# EAGLE schematic Modulator_V1p2 (EAGLE 9.6.2)

## Sheet 1 of 5: Logic
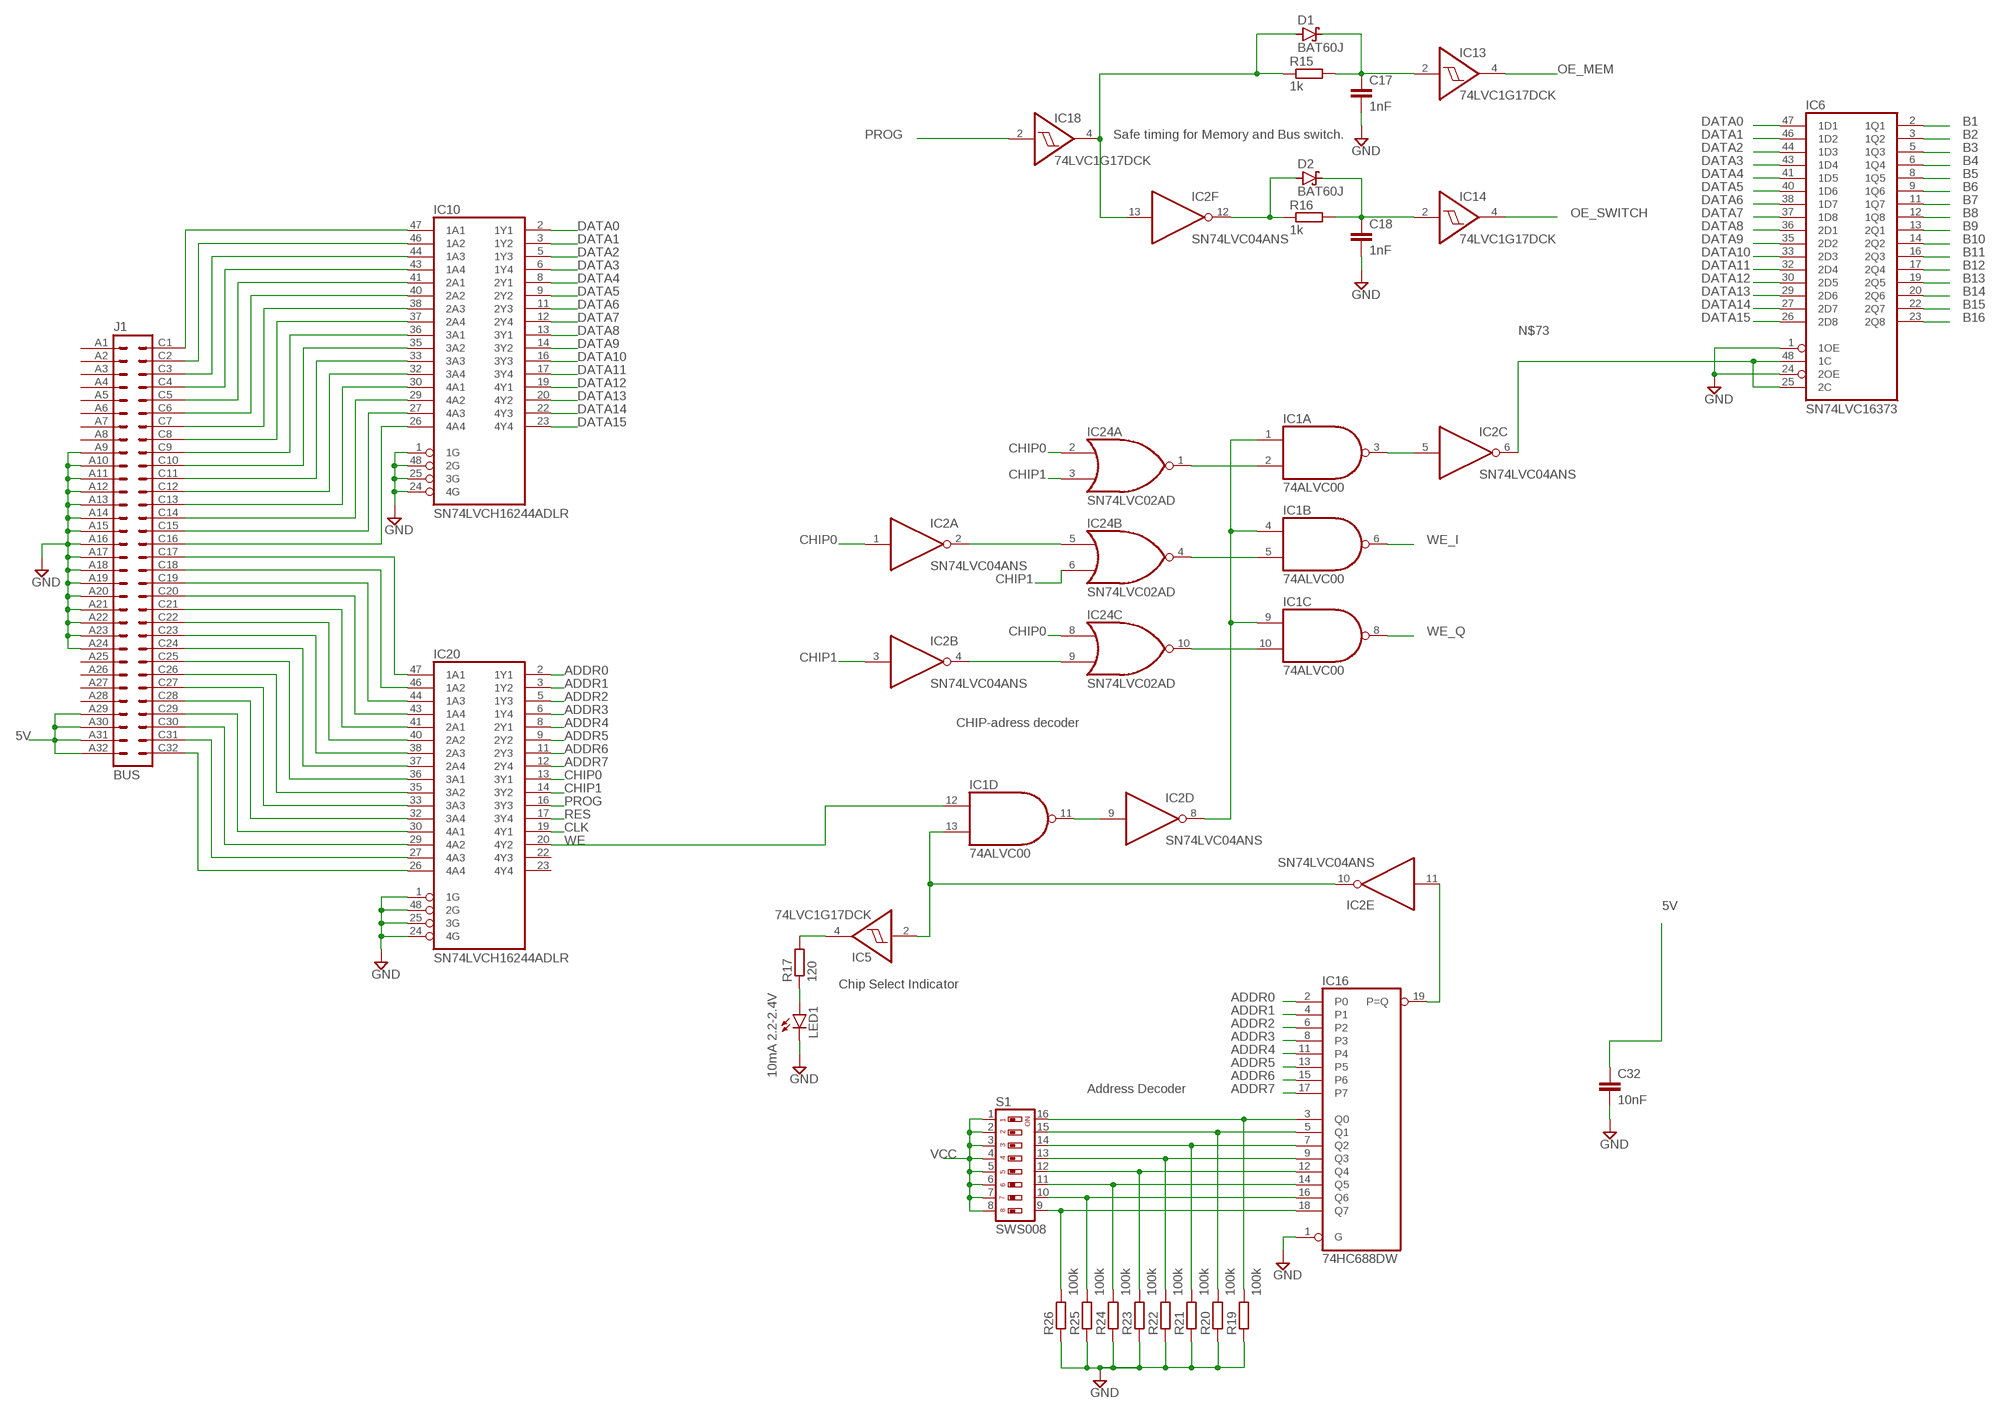
[diagram p0: schematic, sheet 1]

### Parts
C17  1nF  C-EUC0805  [C0805]
C18  1nF  C-EUC0805  [C0805]
C32  10nF  C-EUC0603  [C0603]
D1  BAT60J  [SOD323_ST]
D2  BAT60J  [SOD323_ST]
IC1  74ALVC00  74ALS00D  [SO14]
IC2  SN74LVC04ANS  74ALS04D  [SO14]
IC5  74LVC1G17DCK  [SC70-5]
IC6  SN74LVC16373  74AC16373  [SSOP48DL]
IC10  SN74LVCH16244ADLR  74AC16244  [SSOP48DL]
IC13  74LVC1G17DCK  [SC70-5]
IC14  74LVC1G17DCK  [SC70-5]
IC16  74HC688DW  [SO20W]
IC18  74LVC1G17DCK  [SC70-5]
IC20  SN74LVCH16244ADLR  74AC16244  [SSOP48DL]
IC24  SN74LVC02AD  74AS02D  [SO14]
J1  BUS  VG64B  [VG64B]
LED1  10mA 2.2-2.4V  LED3MM  [LED3MM]
R15  1k  R-EU_R0603  [R0603]
R16  1k  R-EU_R0603  [R0603]
R17  120  R-EU_R0603  [R0603]
R19  100k  R-EU_R0603  [R0603]
R20  100k  R-EU_R0603  [R0603]
R21  100k  R-EU_R0603  [R0603]
R22  100k  R-EU_R0603  [R0603]
R23  100k  R-EU_R0603  [R0603]
R24  100k  R-EU_R0603  [R0603]
R25  100k  R-EU_R0603  [R0603]
R26  100k  R-EU_R0603  [R0603]
S1  SWS008  [SMS-008]

### Nets
5V: C32.1 J1.A29 J1.A30 J1.A31 J1.A32 ; also sheet 2,3,5
ADDR0: IC16.2(P0) IC20.2(1Y1)
ADDR1: IC16.4(P1) IC20.3(1Y2)
ADDR2: IC16.6(P2) IC20.5(1Y3)
ADDR3: IC16.8(P3) IC20.6(1Y4)
ADDR4: IC16.11(P4) IC20.8(2Y1)
ADDR5: IC16.13(P5) IC20.9(2Y2)
ADDR6: IC16.15(P6) IC20.11(2Y3)
ADDR7: IC16.17(P7) IC20.12(2Y4)
B1: IC6.2(1Q1) ; also sheet 4
B2: IC6.3(1Q2) ; also sheet 4
B3: IC6.5(1Q3) ; also sheet 4
B4: IC6.6(1Q4) ; also sheet 4
B5: IC6.8(1Q5) ; also sheet 4
B6: IC6.9(1Q6) ; also sheet 4
B7: IC6.11(1Q7) ; also sheet 4
B8: IC6.12(1Q8) ; also sheet 4
B9: IC6.13(2Q1) ; also sheet 4
B10: IC6.14(2Q2) ; also sheet 4
B11: IC6.16(2Q3) ; also sheet 4
B12: IC6.17(2Q4) ; also sheet 4
B13: IC6.19(2Q5) ; also sheet 4
B14: IC6.20(2Q6) ; also sheet 4
B15: IC6.22(2Q7) ; also sheet 4
B16: IC6.23(2Q8) ; also sheet 4
CHIP0: IC2.1(A:I) IC20.13(3Y1) IC24.2(A:I0) IC24.8(C:I0)
CHIP1: IC2.3(B:I) IC20.14(3Y2) IC24.3(A:I1) IC24.6(B:I1)
CLK: IC20.19(4Y1) ; also sheet 2,4
DATA0: IC6.47(1D1) IC10.2(1Y1) ; also sheet 2
DATA1: IC6.46(1D2) IC10.3(1Y2) ; also sheet 2
DATA2: IC6.44(1D3) IC10.5(1Y3) ; also sheet 2
DATA3: IC6.43(1D4) IC10.6(1Y4) ; also sheet 2
DATA4: IC6.41(1D5) IC10.8(2Y1) ; also sheet 2
DATA5: IC6.40(1D6) IC10.9(2Y2) ; also sheet 2
DATA6: IC6.38(1D7) IC10.11(2Y3) ; also sheet 2
DATA7: IC6.37(1D8) IC10.12(2Y4) ; also sheet 2
DATA8: IC6.36(2D1) IC10.13(3Y1) ; also sheet 2
DATA9: IC6.35(2D2) IC10.14(3Y2) ; also sheet 2
DATA10: IC6.33(2D3) IC10.16(3Y3) ; also sheet 2
DATA11: IC6.32(2D4) IC10.17(3Y4) ; also sheet 2
DATA12: IC6.30(2D5) IC10.19(4Y1) ; also sheet 2
DATA13: IC6.29(2D6) IC10.20(4Y2) ; also sheet 2
DATA14: IC6.27(2D7) IC10.22(4Y3) ; also sheet 2
DATA15: IC6.26(2D8) IC10.23(4Y4) ; also sheet 2
GND: C17.2 C18.2 C32.2 IC6.1(1OE) IC6.24(2OE) IC10.1(1G) IC10.24(4G) IC10.25(3G) IC10.48(2G) IC16.1(G) IC20.1(1G) IC20.24(4G) IC20.25(3G) IC20.48(2G) J1.A9 J1.A10 J1.A11 J1.A12 J1.A13 J1.A14 J1.A15 J1.A16 J1.A17 J1.A18 J1.A19 J1.A20 J1.A21 J1.A22 J1.A23 J1.A24 LED1.K(C) R19.1 R20.1 R21.1 R22.1 R23.1 R24.1 R25.1 R26.1 ; also sheet 2,3,4,5
N$2: IC10.47(1A1) J1.C1
N$3: IC10.46(1A2) J1.C2
N$4: C17.1 D1.C IC13.2(I) R15.2
N$5: IC10.44(1A3) J1.C3
N$6: IC10.43(1A4) J1.C4
N$7: IC10.41(2A1) J1.C5
N$8: IC10.40(2A2) J1.C6
N$9: IC10.38(2A3) J1.C7
N$10: IC10.37(2A4) J1.C8
N$11: IC10.36(3A1) J1.C9
N$12: IC10.35(3A2) J1.C10
N$13: IC10.33(3A3) J1.C11
N$14: IC10.32(3A4) J1.C12
N$15: IC10.30(4A1) J1.C13
N$16: IC10.29(4A2) J1.C14
N$17: IC10.27(4A3) J1.C15
N$18: IC10.26(4A4) J1.C16
N$21: IC20.47(1A1) J1.C17
N$22: IC20.46(1A2) J1.C18
N$23: IC20.44(1A3) J1.C19
N$24: IC20.43(1A4) J1.C20
N$25: IC20.41(2A1) J1.C21
N$26: IC20.40(2A2) J1.C22
N$27: IC20.38(2A3) J1.C23
N$28: IC20.37(2A4) J1.C24
N$29: IC20.36(3A1) J1.C25
N$30: IC20.35(3A2) J1.C26
N$31: IC20.33(3A3) J1.C27
N$40: IC16.3(Q0) R19.2 S1.16
N$60: C18.1 D2.C IC14.2(I) R16.2
N$63: D2.A IC2.12(F:O) R16.1
N$64: IC16.5(Q1) R20.2 S1.15
N$65: IC16.7(Q2) R21.2 S1.14
N$66: IC16.9(Q3) R22.2 S1.13
N$67: IC16.12(Q4) R23.2 S1.12
N$68: IC16.14(Q5) R24.2 S1.11
N$69: IC16.16(Q6) R25.2 S1.10
N$70: IC16.18(Q7) R26.2 S1.9
N$71: IC1.2(A:I1) IC24.1(A:O)
N$72: IC1.5(B:I1) IC24.4(B:O)
N$73: IC2.6(C:O) IC6.25(2C) IC6.48(1C)
N$74: D1.A IC2.13(F:I) IC18.4(O) R15.1
N$75: IC2.2(A:O) IC24.5(B:I0)
N$76: IC2.4(B:O) IC24.9(C:I1)
N$77: IC20.32(3A4) J1.C28
N$78: IC1.10(C:I1) IC24.10(C:O)
N$79: IC1.3(A:O) IC2.5(C:I)
N$80: IC2.11(E:I) IC16.19(P=Q)
N$81: IC1.13(D:I1) IC2.10(E:O) IC5.2(I)
N$82: IC1.1(A:I0) IC1.4(B:I0) IC1.9(C:I0) IC2.8(D:O)
N$83: IC1.11(D:O) IC2.9(D:I)
N$84: IC20.30(4A1) J1.C29
N$85: IC20.29(4A2) J1.C30
N$86: IC20.27(4A3) J1.C31
N$87: IC20.26(4A4) J1.C32
N$88: LED1.A R17.1
N$89: IC5.4(O) R17.2
OE_MEM: IC13.4(O) ; also sheet 2
OE_SWITCH: IC14.4(O) ; also sheet 2
PROG: IC18.2(I) IC20.16(3Y3)
RES: IC20.17(3Y4) ; also sheet 4
VCC: S1.1 S1.2 S1.3 S1.4 S1.5 S1.6 S1.7 S1.8 ; also sheet 2,4,5
WE: IC1.12(D:I0) IC20.20(4Y2)
WE_I: IC1.6(B:O) ; also sheet 2
WE_Q: IC1.8(C:O) ; also sheet 2
Unconnected: IC20.22(4Y3) IC20.23(4Y4) J1.A1 J1.A2 J1.A3 J1.A4 J1.A5 J1.A6 J1.A7 J1.A8 J1.A25 J1.A26 J1.A27 J1.A28

### Notes on the sheet
- Safe timing for Memory and Bus switch.
- CHIP-adress decoder
- Chip Select Indicator
- Address Decoder

## Sheet 2 of 5: Memory + DAC
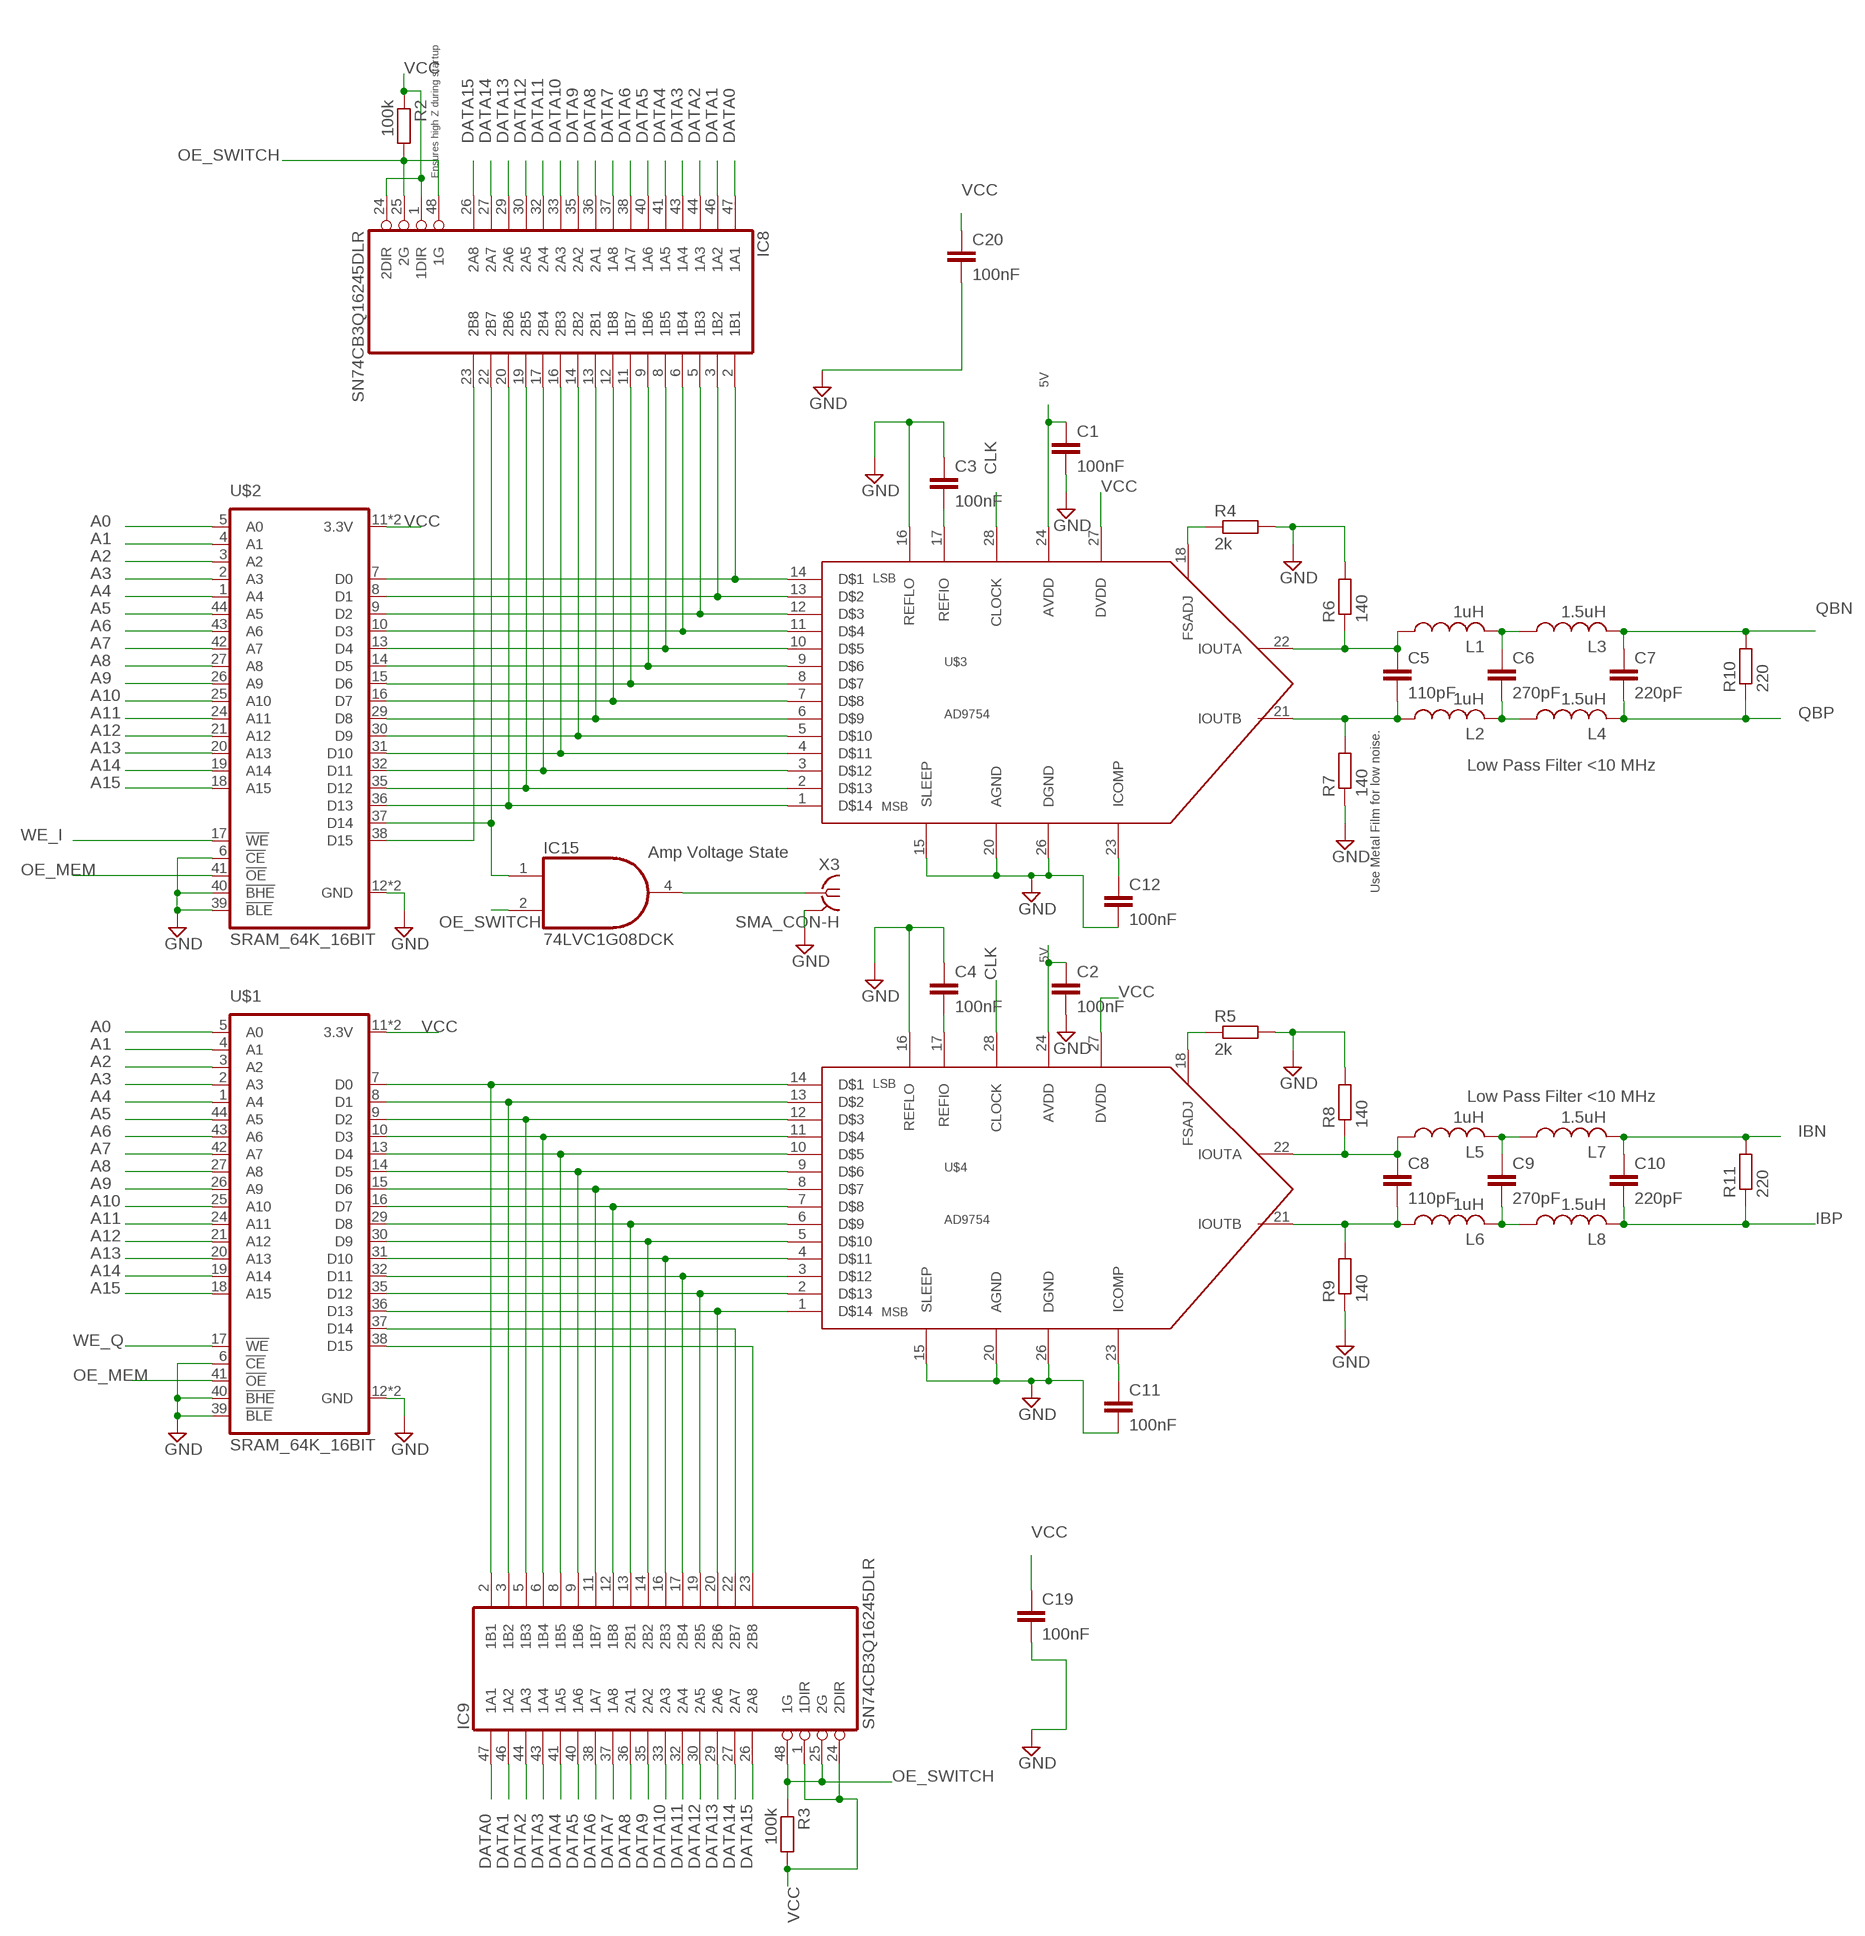
[diagram p1: schematic, sheet 2]

### Parts
C1  100nF  C-EUC0603  [C0603]
C2  100nF  C-EUC0603  [C0603]
C3  100nF  C-EUC0603  [C0603]
C4  100nF  C-EUC0603  [C0603]
C5  110pF  C-EUC0603  [C0603]
C6  270pF  C-EUC0603  [C0603]
C7  220pF  C-EUC0603  [C0603]
C8  110pF  C-EUC0603  [C0603]
C9  270pF  C-EUC0603  [C0603]
C10  220pF  C-EUC0603  [C0603]
C11  100nF  C-EUC0603  [C0603]
C12  100nF  C-EUC0603  [C0603]
C19  100nF  C-EUC0603  [C0603]
C20  100nF  C-EUC0603  [C0603]
IC8  SN74CB3Q16245DLR  74AC16245  [SSOP48DL]
IC9  SN74CB3Q16245DLR  74AC16245  [SSOP48DL]
IC15  74LVC1G08DCK  [SC70-5]
L1  1uH  L-USL2012C  [L2012C]
L2  1uH  L-USL2012C  [L2012C]
L3  1.5uH  L-USL2012C  [L2012C]
L4  1.5uH  L-USL2012C  [L2012C]
L5  1uH  L-USL2012C  [L2012C]
L6  1uH  L-USL2012C  [L2012C]
L7  1.5uH  L-USL2012C  [L2012C]
L8  1.5uH  L-USL2012C  [L2012C]
R2  100k  R-EU_R0603  [R0603]
R3  100k  R-EU_R0603  [R0603]
R4  2k  R-EU_R0603  [R0603]
R5  2k  R-EU_R0603  [R0603]
R6  140  R-EU_R0603  [R0603]
R7  140  R-EU_R0603  [R0603]
R8  140  R-EU_R0603  [R0603]
R9  140  R-EU_R0603  [R0603]
R10  220  R-EU_R0603  [R0603]
R11  220  R-EU_R0603  [R0603]
U$1  SRAM_64K_16BIT  [TSOPII-Z44]
U$2  SRAM_64K_16BIT  [TSOPII-Z44]
U$3  AD9754  [TSSOP28]
U$4  AD9754  [TSSOP28]
X3  SMA_CON-H  [BU-SMA-H]

### Nets
5V: C1.1 C2.1 U$3.24(AVDD) U$4.24(AVDD) ; also sheet 1,3,5
A0: U$1.5(A0) U$2.5(A0) ; also sheet 4
A1: U$1.4(A1) U$2.4(A1) ; also sheet 4
A2: U$1.3(A2) U$2.3(A2) ; also sheet 4
A3: U$1.2(A3) U$2.2(A3) ; also sheet 4
A4: U$1.1(A4) U$2.1(A4) ; also sheet 4
A5: U$1.44(A5) U$2.44(A5) ; also sheet 4
A6: U$1.43(A6) U$2.43(A6) ; also sheet 4
A7: U$1.42(A7) U$2.42(A7) ; also sheet 4
A8: U$1.27(A8) U$2.27(A8) ; also sheet 4
A9: U$1.26(A9) U$2.26(A9) ; also sheet 4
A10: U$1.25(A10) U$2.25(A10) ; also sheet 4
A11: U$1.24(A11) U$2.24(A11) ; also sheet 4
A12: U$1.21(A12) U$2.21(A12) ; also sheet 4
A13: U$1.20(A13) U$2.20(A13) ; also sheet 4
A14: U$1.19(A14) U$2.19(A14) ; also sheet 4
A15: U$1.18(A15) U$2.18(A15) ; also sheet 4
CLK: U$3.28(CLOCK) U$4.28(CLOCK) ; also sheet 1,4
DATA0: IC8.47(1A1) IC9.47(1A1) ; also sheet 1
DATA1: IC8.46(1A2) IC9.46(1A2) ; also sheet 1
DATA2: IC8.44(1A3) IC9.44(1A3) ; also sheet 1
DATA3: IC8.43(1A4) IC9.43(1A4) ; also sheet 1
DATA4: IC8.41(1A5) IC9.41(1A5) ; also sheet 1
DATA5: IC8.40(1A6) IC9.40(1A6) ; also sheet 1
DATA6: IC8.38(1A7) IC9.38(1A7) ; also sheet 1
DATA7: IC8.37(1A8) IC9.37(1A8) ; also sheet 1
DATA8: IC8.36(2A1) IC9.36(2A1) ; also sheet 1
DATA9: IC8.35(2A2) IC9.35(2A2) ; also sheet 1
DATA10: IC8.33(2A3) IC9.33(2A3) ; also sheet 1
DATA11: IC8.32(2A4) IC9.32(2A4) ; also sheet 1
DATA12: IC8.30(2A5) IC9.30(2A5) ; also sheet 1
DATA13: IC8.29(2A6) IC9.29(2A6) ; also sheet 1
DATA14: IC8.27(2A7) IC9.27(2A7) ; also sheet 1
DATA15: IC8.26(2A8) IC9.26(2A8) ; also sheet 1
DI0: IC8.2(1B1) U$2.7(D0) U$3.14(D$1)
DI1: IC8.3(1B2) U$2.8(D1) U$3.13(D$2)
DI2: IC8.5(1B3) U$2.9(D2) U$3.12(D$3)
DI3: IC8.6(1B4) U$2.10(D3) U$3.11(D$4)
DI4: IC8.8(1B5) U$2.13(D4) U$3.10(D$5)
DI5: IC8.9(1B6) U$2.14(D5) U$3.9(D$6)
DI6: IC8.11(1B7) U$2.15(D6) U$3.8(D$7)
DI7: IC8.12(1B8) U$2.16(D7) U$3.7(D$8)
DI8: IC8.13(2B1) U$2.29(D8) U$3.6(D$9)
DI9: IC8.14(2B2) U$2.30(D9) U$3.5(D$10)
DI10: IC8.16(2B3) U$2.31(D10) U$3.4(D$11)
DI11: IC8.17(2B4) U$2.32(D11) U$3.3(D$12)
DI12: IC8.19(2B5) U$2.35(D12) U$3.2(D$13)
DI13: IC8.20(2B6) U$2.36(D13) U$3.1(D$14)
DQ0: IC9.2(1B1) U$1.7(D0) U$4.14(D$1)
DQ1: IC9.3(1B2) U$1.8(D1) U$4.13(D$2)
DQ2: IC9.5(1B3) U$1.9(D2) U$4.12(D$3)
DQ3: IC9.6(1B4) U$1.10(D3) U$4.11(D$4)
DQ4: IC9.8(1B5) U$1.13(D4) U$4.10(D$5)
DQ5: IC9.9(1B6) U$1.14(D5) U$4.9(D$6)
DQ6: IC9.11(1B7) U$1.15(D6) U$4.8(D$7)
DQ7: IC9.12(1B8) U$1.16(D7) U$4.7(D$8)
DQ8: IC9.13(2B1) U$1.29(D8) U$4.6(D$9)
DQ9: IC9.14(2B2) U$1.30(D9) U$4.5(D$10)
DQ10: IC9.16(2B3) U$1.31(D10) U$4.4(D$11)
DQ11: IC9.17(2B4) U$1.32(D11) U$4.3(D$12)
DQ12: IC9.19(2B5) U$1.35(D12) U$4.2(D$13)
DQ13: IC9.20(2B6) U$1.36(D13) U$4.1(D$14)
GND: C1.2 C2.2 C3.1 C4.1 C11.2 C12.2 C19.2 C20.2 R4.2 R5.2 R6.2 R7.1 R8.2 R9.1 U$1.6(!CE) U$1.12(GND) U$1.34(GND) U$1.39(!BLE) U$1.40(!BHE) U$2.6(!CE) U$2.12(GND) U$2.34(GND) U$2.39(!BLE) U$2.40(!BHE) U$3.15(SLEEP) U$3.16(REFLO) U$3.20(AGND) U$3.26(DGND) U$4.15(SLEEP) U$4.16(REFLO) U$4.20(AGND) U$4.26(DGND) X3.2(GND) X3.3(GND) X3.4(GND) X3.5(GND) ; also sheet 1,3,4,5
IBN: C10.1 L7.2 R11.2 ; also sheet 3
IBP: C10.2 L8.2 R11.1 ; also sheet 3
N$32: IC8.22(2B7) IC15.1(I0) U$2.37(D14)
N$33: IC8.23(2B8) U$2.38(D15)
N$34: IC9.22(2B7) U$1.37(D14)
N$35: IC9.23(2B8) U$1.38(D15)
N$37: R5.1 U$4.18(FSADJ)
N$38: IC15.4(O) X3.1
N$39: C6.1 L1.2 L3.1
N$41: R4.1 U$3.18(FSADJ)
N$42: C6.2 L2.2 L4.1
N$43: C3.2 U$3.17(REFIO)
N$45: C4.2 U$4.17(REFIO)
N$47: C8.1 L5.1 R8.1 U$4.22(IOUTA)
N$48: C8.2 L6.1 R9.2 U$4.21(IOUTB)
N$49: C5.1 L1.1 R6.1 U$3.22(IOUTA)
N$50: C9.1 L5.2 L7.1
N$51: C5.2 L2.1 R7.2 U$3.21(IOUTB)
N$52: C11.1 U$4.23(ICOMP)
N$53: C9.2 L6.2 L8.1
N$57: C12.1 U$3.23(ICOMP)
OE_MEM: U$1.41(!OE) U$2.41(!OE) ; also sheet 1
OE_SWITCH: IC8.25(2G) IC8.48(1G) IC9.25(2G) IC9.48(1G) IC15.2(I1) R2.2 R3.1 ; also sheet 1
QBN: C7.1 L3.2 R10.2 ; also sheet 3
QBP: C7.2 L4.2 R10.1 ; also sheet 3
VCC: C19.1 C20.1 IC8.1(1DIR) IC8.24(2DIR) IC9.1(1DIR) IC9.24(2DIR) R2.1 R3.2 U$1.11(3.3V) U$1.33(3.3V) U$2.11(3.3V) U$2.33(3.3V) U$3.27(DVDD) U$4.27(DVDD) ; also sheet 1,4,5
WE_I: U$2.17(!WE) ; also sheet 1
WE_Q: U$1.17(!WE) ; also sheet 1

### Notes on the sheet
- Ensures high Z during startup
- Low Pass Filter <10 MHz
- Amp Voltage State
- Use Metal Film for low noise.
- Low Pass Filter <10 MHz

## Sheet 3 of 5: Modulator
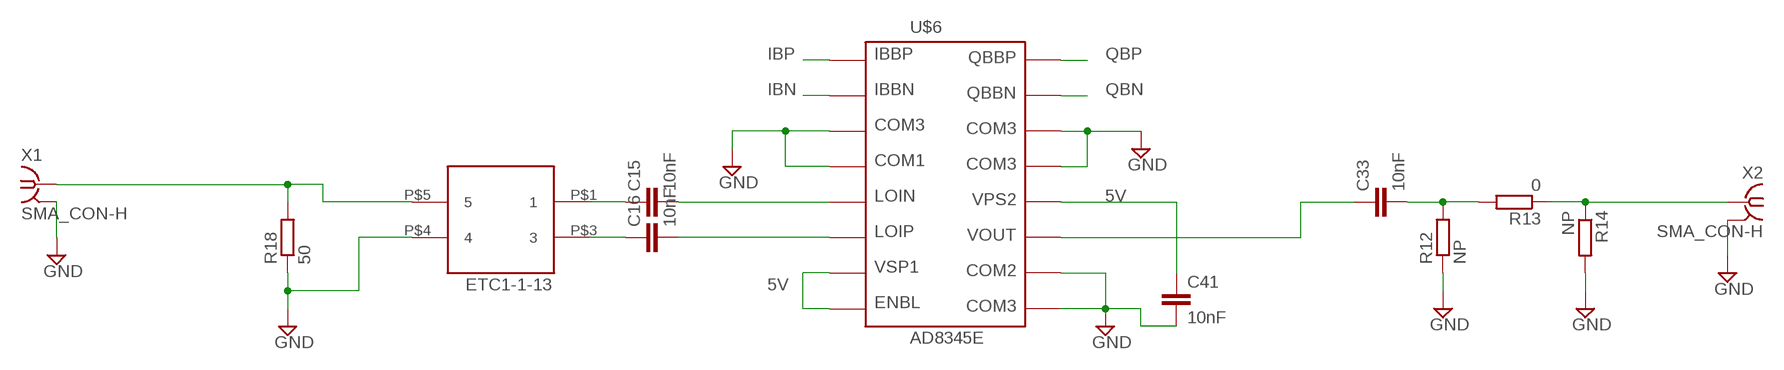
[diagram p2: schematic, sheet 3]

### Parts
C15  10nF  C-EUC0402  [C0402]
C16  10nF  C-EUC0402  [C0402]
C33  10nF  C-EUC0402  [C0402]
C41  10nF  C-EUC0603  [C0603]
R12  NP  R-EU_R0805  [R0805]
R13  0  R-EU_R0805  [R0805]
R14  NP  R-EU_R0805  [R0805]
R18  50  R-EU_R0603  [R0603]
U$6  AD8345E  [TSSOP16EXP]
U$12  ETC1-1-13  [ETC1-1-13]
X1  SMA_CON-H  [BU-SMA-H]
X2  SMA_CON-H  [BU-SMA-H]

### Nets
5V: C41.1 U$6.7 U$6.8 U$6.12 ; also sheet 1,2,5
GND: C41.2 R12.1 R14.2 R18.1 U$6.3 U$6.4 U$6.9 U$6.10 U$6.13 U$6.14 U$6.EXP U$12.P$4 X1.2(GND) X1.3(GND) X1.4(GND) X1.5(GND) X2.2(GND) X2.3(GND) X2.4(GND) X2.5(GND) ; also sheet 1,2,4,5
IBN: U$6.2 ; also sheet 2
IBP: U$6.1 ; also sheet 2
N$1: C33.1 U$6.11
N$44: C15.1 U$12.P$1
N$46: C16.1 U$12.P$3
N$54: R18.2 U$12.P$5 X1.1
N$55: C15.2 U$6.5
N$56: C16.2 U$6.6
N$61: R13.1 R14.1 X2.1
N$62: C33.2 R12.2 R13.2
QBN: U$6.15 ; also sheet 2
QBP: U$6.16 ; also sheet 2

## Sheet 4 of 5: Counter
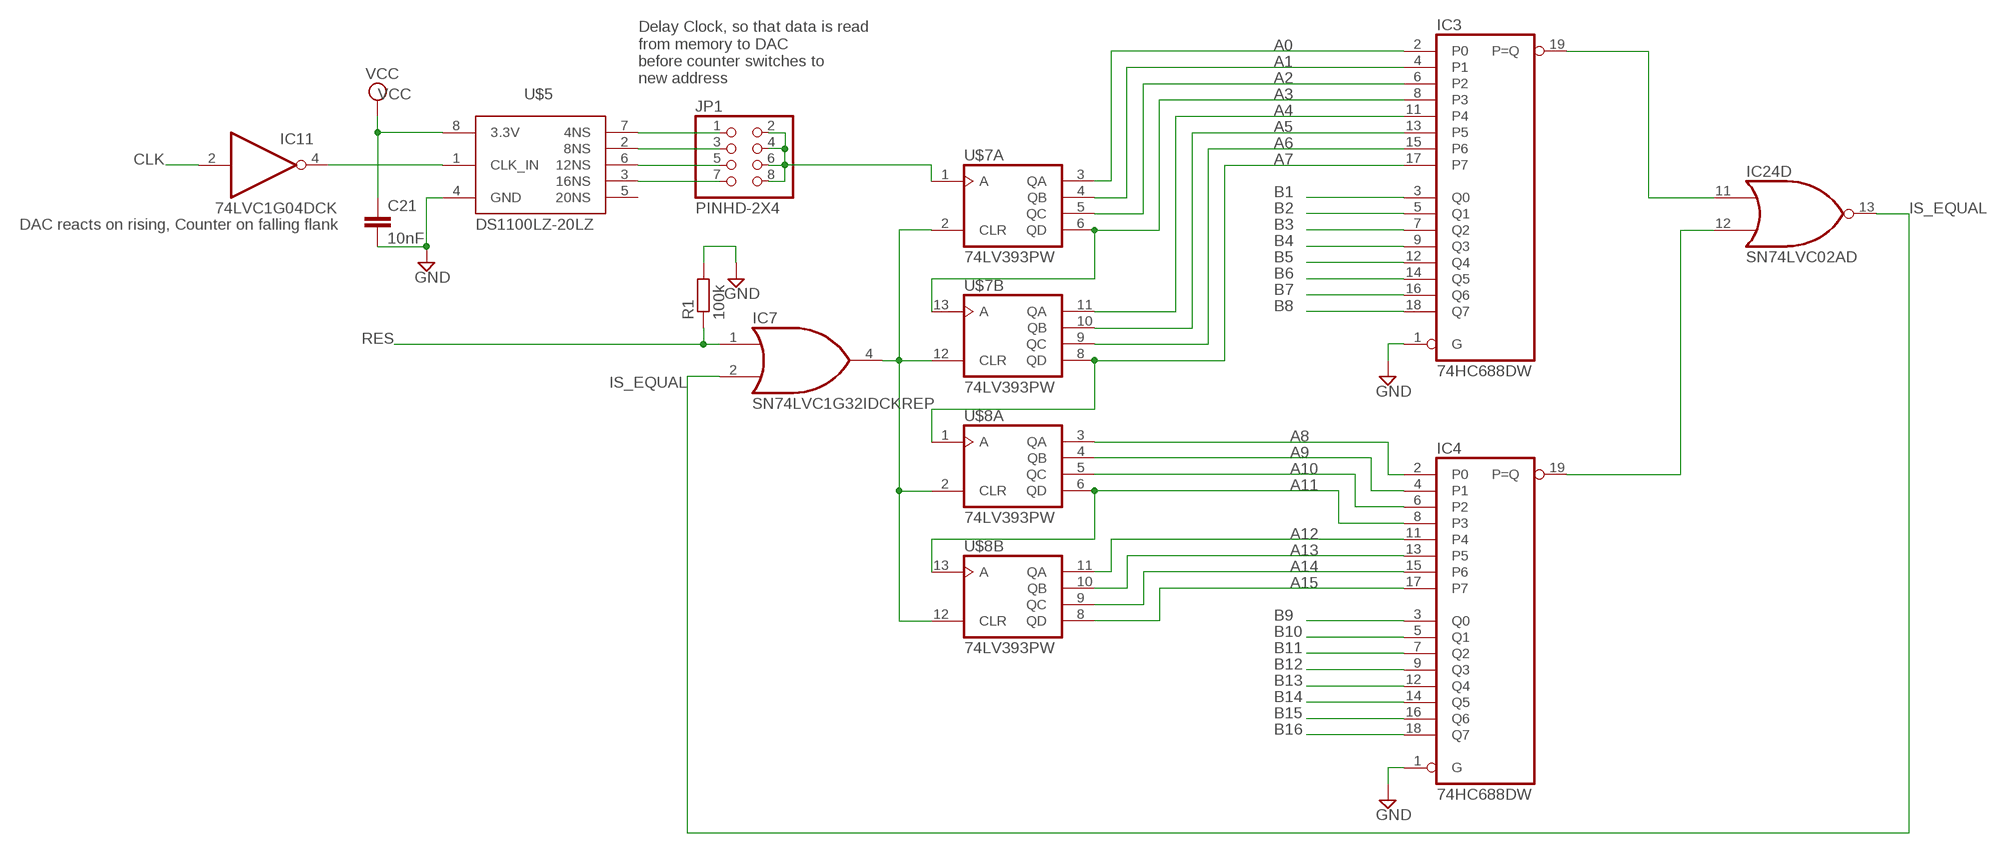
[diagram p3: schematic, sheet 4]

### Parts
C21  10nF  C-EUC0603  [C0603]
IC3  74HC688DW  [SO20W]
IC4  74HC688DW  [SO20W]
IC7  SN74LVC1G32IDCKREP  74AHC1G32DCK  [SC70-5]
IC11  74LVC1G04DCK  [SC70-5]
JP1  PINHD-2X4  [2X04]
R1  100k  R-EU_R0603  [R0603]
U$5  DS1100LZ-20LZ  [SO-08]
U$7  74LV393PW  [TSSOP14]
U$8  74LV393PW  [TSSOP14]

### Nets
A0: IC3.2(P0) U$7.3(A:QA) ; also sheet 2
A1: IC3.4(P1) U$7.4(A:QB) ; also sheet 2
A2: IC3.6(P2) U$7.5(A:QC) ; also sheet 2
A3: IC3.8(P3) U$7.6(A:QD) U$7.13(B:A) ; also sheet 2
A4: IC3.11(P4) U$7.11(B:QA) ; also sheet 2
A5: IC3.13(P5) U$7.10(B:QB) ; also sheet 2
A6: IC3.15(P6) U$7.9(B:QC) ; also sheet 2
A7: IC3.17(P7) U$7.8(B:QD) U$8.1(A:A) ; also sheet 2
A8: IC4.2(P0) U$8.3(A:QA) ; also sheet 2
A9: IC4.4(P1) U$8.4(A:QB) ; also sheet 2
A10: IC4.6(P2) U$8.5(A:QC) ; also sheet 2
A11: IC4.8(P3) U$8.6(A:QD) U$8.13(B:A) ; also sheet 2
A12: IC4.11(P4) U$8.11(B:QA) ; also sheet 2
A13: IC4.13(P5) U$8.10(B:QB) ; also sheet 2
A14: IC4.15(P6) U$8.9(B:QC) ; also sheet 2
A15: IC4.17(P7) U$8.8(B:QD) ; also sheet 2
B1: IC3.3(Q0) ; also sheet 1
B2: IC3.5(Q1) ; also sheet 1
B3: IC3.7(Q2) ; also sheet 1
B4: IC3.9(Q3) ; also sheet 1
B5: IC3.12(Q4) ; also sheet 1
B6: IC3.14(Q5) ; also sheet 1
B7: IC3.16(Q6) ; also sheet 1
B8: IC3.18(Q7) ; also sheet 1
B9: IC4.3(Q0) ; also sheet 1
B10: IC4.5(Q1) ; also sheet 1
B11: IC4.7(Q2) ; also sheet 1
B12: IC4.9(Q3) ; also sheet 1
B13: IC4.12(Q4) ; also sheet 1
B14: IC4.14(Q5) ; also sheet 1
B15: IC4.16(Q6) ; also sheet 1
B16: IC4.18(Q7) ; also sheet 1
CLK: IC11.2(I) ; also sheet 1,2
CLR: IC7.4(O) U$7.2(A:CLR) U$7.12(B:CLR) U$8.2(A:CLR) U$8.12(B:CLR)
GND: C21.2 IC3.1(G) IC4.1(G) R1.2 U$5.4(GND) ; also sheet 1,2,3,5
IS_EQUAL: IC7.2(I1) IC24.13(D:O)
N$19: IC3.19(P=Q) IC24.11(D:I0)
N$20: IC4.19(P=Q) IC24.12(D:I1)
N$36: JP1.2 JP1.4 JP1.6 JP1.8 U$7.1(A:A)
N$90: IC11.4(O) U$5.1(CLK_IN)
N$92: JP1.1 U$5.7(4NS)
N$93: JP1.3 U$5.2(8NS)
N$94: JP1.5 U$5.6(12NS)
N$95: JP1.7 U$5.3(16NS)
RES: IC7.1(I0) R1.1 ; also sheet 1
VCC: C21.1 U$5.8(3.3V) ; also sheet 1,2,5
Unconnected: U$5.5(20NS)

### Notes on the sheet
- Delay Clock, so that data is read
  from memory to DAC
  before counter switches to
  new address
- DAC reacts on rising, Counter on falling flank

## Sheet 5 of 5: Power Supply
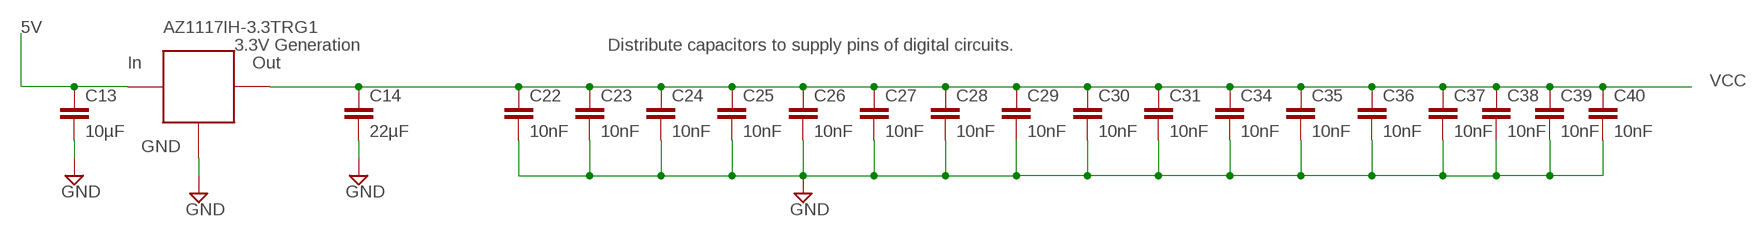
[diagram p4: schematic, sheet 5]

### Parts
C13  10µF  C-EUC1206  [C1206]
C14  22µF  C-EUC1206  [C1206]
C22  10nF  C-EUC0603  [C0603]
C23  10nF  C-EUC0603  [C0603]
C24  10nF  C-EUC0603  [C0603]
C25  10nF  C-EUC0603  [C0603]
C26  10nF  C-EUC0603  [C0603]
C27  10nF  C-EUC0603  [C0603]
C28  10nF  C-EUC0603  [C0603]
C29  10nF  C-EUC0603  [C0603]
C30  10nF  C-EUC0603  [C0603]
C31  10nF  C-EUC0603  [C0603]
C34  10nF  C-EUC0603  [C0603]
C35  10nF  C-EUC0603  [C0603]
C36  10nF  C-EUC0603  [C0603]
C37  10nF  C-EUC0603  [C0603]
C38  10nF  C-EUC0603  [C0603]
C39  10nF  C-EUC0603  [C0603]
C40  10nF  C-EUC0603  [C0603]
U$9  AZ1117IH-3.3TRG1  LT1117  [SOT223]

### Nets
5V: C13.1 U$9.3(IN) ; also sheet 1,2,3
GND: C13.2 C14.2 C22.2 C23.2 C24.2 C25.2 C26.2 C27.2 C28.2 C29.2 C30.2 C31.2 C34.2 C35.2 C36.2 C37.2 C38.2 C39.2 C40.2 U$9.1(GND) ; also sheet 1,2,3,4
VCC: C14.1 C22.1 C23.1 C24.1 C25.1 C26.1 C27.1 C28.1 C29.1 C30.1 C31.1 C34.1 C35.1 C36.1 C37.1 C38.1 C39.1 C40.1 U$9.2(OUT) U$9.4(OUT) ; also sheet 1,2,4

### Notes on the sheet
- 3.3V Generation | Distribute capacitors to supply pins of digital circuits.

## Power pins joined to a net without a drawn wire
GND: IC1.7(P:GND) IC2.7(P:GND) IC3.10(GND) IC4.10(GND) IC5.3(GND) IC6.4(GND) IC6.10(GND) IC6.15(GND) IC6.21(GND) IC6.28(GND) IC6.34(GND) IC6.39(GND) IC6.45(GND) IC7.3(GND) IC8.4(GND) IC8.10(GND) IC8.15(GND) IC8.21(GND) IC8.28(GND) IC8.34(GND) IC8.39(GND) IC8.45(GND) IC9.4(GND) IC9.10(GND) IC9.15(GND) IC9.21(GND) IC9.28(GND) IC9.34(GND) IC9.39(GND) IC9.45(GND) IC10.4(GND) IC10.10(GND) IC10.15(GND) IC10.21(GND) IC10.28(GND) IC10.34(GND) IC10.39(GND) IC10.45(GND) IC11.3(GND) IC13.3(GND) IC14.3(GND) IC15.3(GND) IC16.10(GND) IC18.3(GND) IC20.4(GND) IC20.10(GND) IC20.15(GND) IC20.21(GND) IC20.28(GND) IC20.34(GND) IC20.39(GND) IC20.45(GND) IC24.7(P:GND) U$7.7(P:GND) U$8.7(P:GND)
VCC: IC1.14(P:VCC) IC2.14(P:VCC) IC3.20(VCC) IC4.20(VCC) IC5.5(VCC) IC6.7(VCC) IC6.18(VCC) IC6.31(VCC) IC6.42(VCC) IC7.5(VCC) IC8.7(VCC) IC8.18(VCC) IC8.31(VCC) IC8.42(VCC) IC9.7(VCC) IC9.18(VCC) IC9.31(VCC) IC9.42(VCC) IC10.7(VCC) IC10.18(VCC) IC10.31(VCC) IC10.42(VCC) IC11.5(VCC) IC13.5(VCC) IC14.5(VCC) IC15.5(VCC) IC16.20(VCC) IC18.5(VCC) IC20.7(VCC) IC20.18(VCC) IC20.31(VCC) IC20.42(VCC) IC24.14(P:VCC) U$7.14(P:VCC) U$8.14(P:VCC)

## Library data of the parts
C1-C41 = rcl:C-EU: CAPACITOR, European symbol; SPICEPREFIX: C
D1 D2 = diode:BAT60J: Schottky barrier diode Source: www.st.com, BAT60J.pdf
IC1 = 74xx-us:74*00: Quad 2-input NAND gate
IC2 = 74xx-us:74*04: Hex INVERTER
IC3 IC4 IC16 = 74xx-eu:74*688: 8-bit MAGNITUDE/IDENTITY COMPARATOR, totem pole
IC5 IC13 IC14 IC18 = 74xx-little-de:74*1G17: Single Schmitt-Trigger Buffer
IC6 = 74ac-logic:74AC16373: 16-bit transparent D-type LATCH, 3-state
IC7 = 74xx-little-us:74*1G32: 2-input OR gate
IC8 IC9 = 74ac-logic:74AC16245: 16-bit BUS TRANSCEIVER, 3-state
IC10 IC20 = 74ac-logic:74AC16244: 16-bit BUFFER/LINE DRIVER, 3-state
IC11 = 74xx-little-us:74*1G04: INVERTER Gate
IC15 = 74xx-little-us:74*1G08: 2-input AND gate
IC24 = 74xx-us:74*02: Quad 2-input NOR gate
J1 = 19inch:VG64: PCB EUROCARD, 64-pin type C/AC, 2.54 mm
JP1 = Connector:PINHD-2X4: PIN HEADER; CATEGORY: CONNECTOR; SUB-CATEGORY: PIN-HEADER
L1-L8 = rcl:L-US: INDUCTOR, American symbol; SPICEPREFIX: L
LED1 = led:LED: LED OSRAM: - CHIPLED LG R971, LG N971, LY N971, LG Q971, LY Q971, LO R971, LY R971 LH N974, LH R974 LS Q976, LO Q976, LY Q976 LO Q996 - Hyper CHIPLED LW Q18S LB Q993, LB Q99A, LB R99A - SideLED LS A670, LO A670, LY A670, LG A670, LP A670 LB A673, LV A673, LT A673, LW A673 LH A674 LY A675 LS A676, LA A676, LO A676, LY A676, LW A676 LS A679, LY A679, LG A679 - Hyper Micro SIDELED® LS Y876, LA Y876, LO Y876, LY Y876 LT Y87S - SmartLED LW L88C, LW L88S LB L89C, LB L89S, LG L890 LS L89K, LO L89K, LY L89K LS L896, LA L896, LO L896, LY L896 - TOPLED LS T670, LO T670, LY T670, LG T670, LP T670 LSG T670, LSP T670, LSY T670, LOP T670, LYG T670 LG T671, LOG T671, LSG T671 LB T673, LV T673, LT T673, LW T673 LH T674 LS T676, LA T676, LO T676, LY T676, LB T676, LH T676, LSB T676, LW T676 LB T67C, LV T67C, LT T67C, LS T67K, LO T67K, LY T67K, LW E67C LS E67B, LA E67B, LO E67B, LY E67B, LB E67C, LV E67C, LT E67C LW T67C LS T679, LY T679, LG T679 LS T770, LO T770, LY T770, LG T770, LP T770 LB T773, LV T773, LT T773, LW T773 LH T774 LS E675, LA E675, LY E675, LS T675 LS T776, LA T776, LO T776, LY T776, LB T776 LHGB T686 LT T68C, LB T68C - Hyper Mini TOPLED® LB M676 - Mini TOPLED Santana® LG M470 LS M47K, LO M47K, LY M47K Source: http://www.osram.convergy.de LUXEON: - LUMILED® LXK2-PW12-R00, LXK2-PW12-S00, LXK2-PW14-U00, LXK2-PW14-V00 LXK2-PM12-R00, LXK2-PM12-S00, LXK2-PM14-U00 LXK2-PE12-Q00, LXK2-PE12-R00, LXK2-PE12-S00, LXK2-PE14-T00, LXK2-PE14-U00 LXK2-PB12-K00, LXK2-PB12-L00, LXK2-PB12-M00, LXK2-PB14-N00, LXK2-PB14-P00, LXK2-PB14-Q00 LXK2-PR12-L00, LXK2-PR12-M00, LXK2-PR14-Q00, LXK2-PR14-R00 LXK2-PD12-Q00, LXK2-PD12-R00, LXK2-PD12-S00 LXK2-PH12-R00, LXK2-PH12-S00 LXK2-PL12-P00, LXK2-PL12-Q00, LXK2-PL12-R00 Source: www.luxeon.com KINGBRIGHT: KA-3528ASYC Source: www.kingbright.com
R1-R26 = rcl:R-EU_: RESISTOR, European symbol; SPICEPREFIX: R
S1 = smd-special:SWS008: SMD Dip Switch 8 pol.
U$1 U$2 = Orzada:SRAM_64K_16BIT: SRAM 64K x 16bit. Like Cypress (Infineon)
U$3 U$4 = Orzada:AD9754: 14-Bit, 125 MSPS TxDAC D/A Converter
U$5 = Orzada:DS1100LZ-20: 5-Tap Timing Element, 4,8,12,16,20 ns delay.
U$6 = Orzada:AD8345: AD8345 IQ-Modulator TSSOP16 with exposed pad.
U$7 U$8 = Orzada:74LV393PW
U$9 = Orzada:LT1117
U$12 = Orzada:ETC1-1-13
X1-X3 = Orzada:SMA_CON